# Altium schematic sheet Microcontroller.SchDoc: Smartknob Microcontroller
size A3; DrawnBy: Mani Magnusson; Revision: 1; SheetNumber: 2; SheetTotal: 5
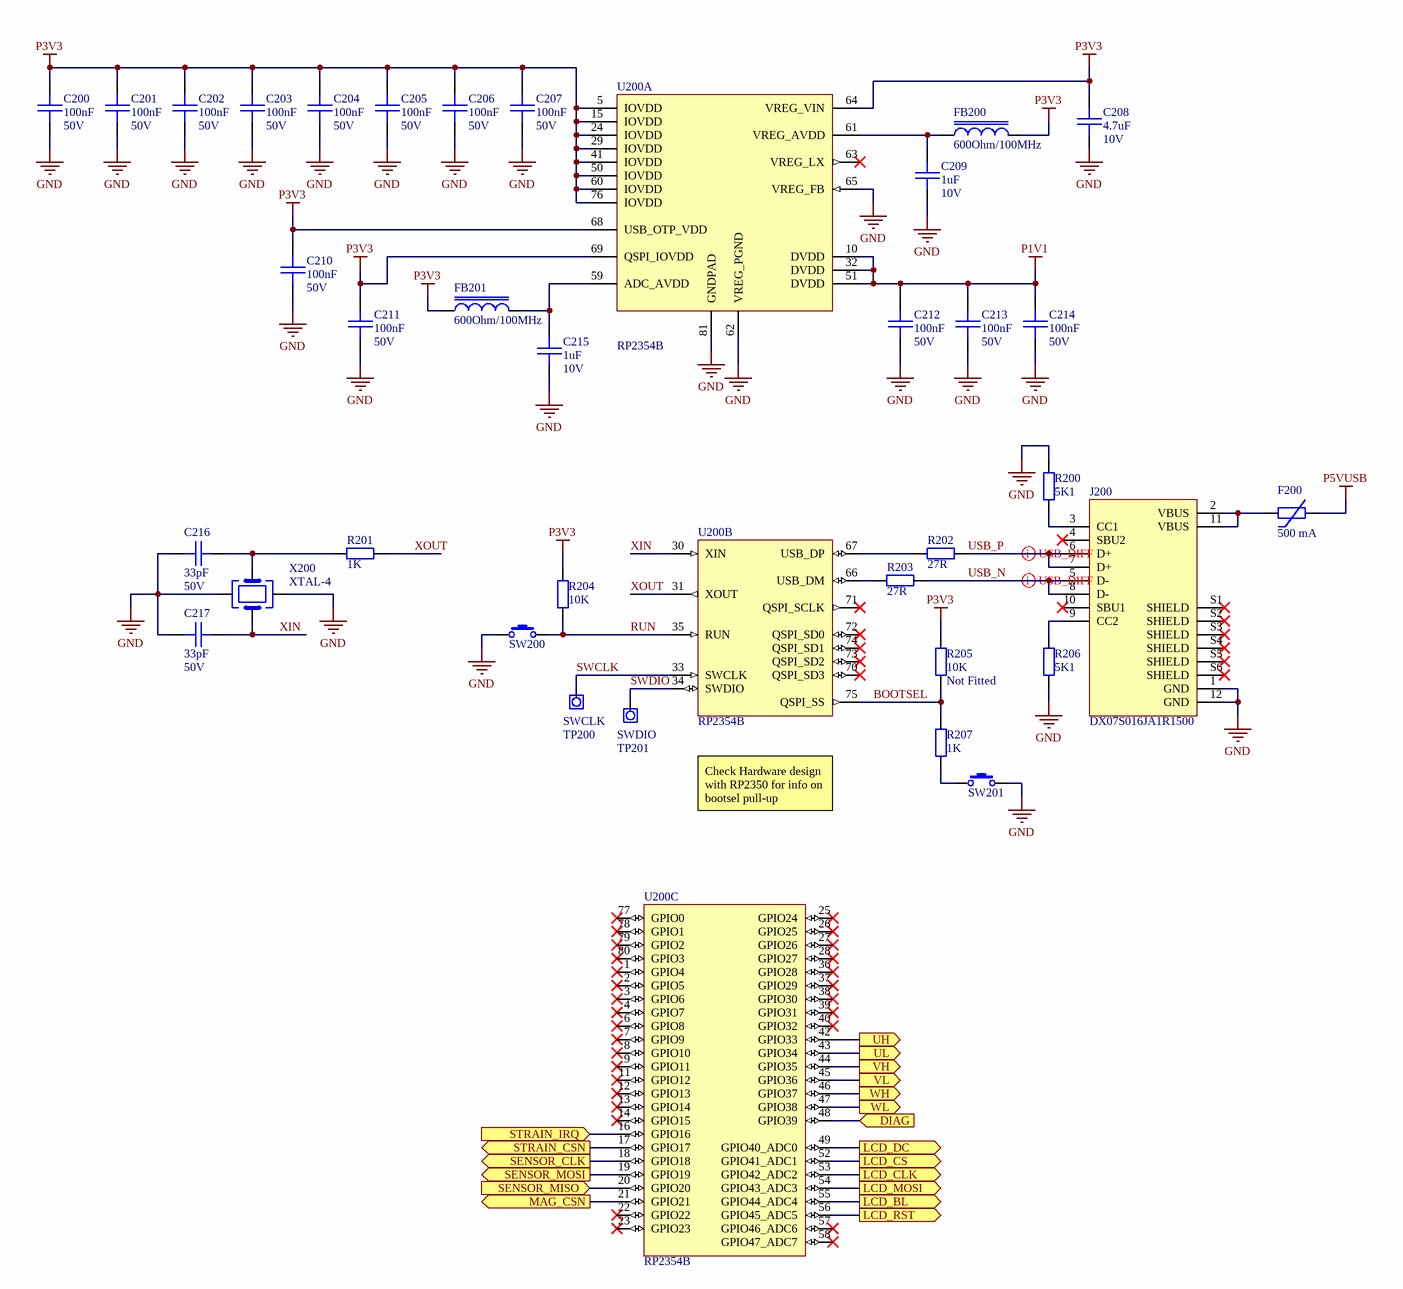
[diagram p0: Microcontroller.SchDoc]

## Parts
C200  value 100nF  Voltage: 50V  [C0402]  (hidden comment: CAP)
C201  value 100nF  Voltage: 50V  [C0402]  (hidden comment: CAP)
C202  value 100nF  Voltage: 50V  [C0402]  (hidden comment: CAP)
C203  value 100nF  Voltage: 50V  [C0402]  (hidden comment: CAP)
C204  value 100nF  Voltage: 50V  [C0402]  (hidden comment: CAP)
C205  value 100nF  Voltage: 50V  [C0402]  (hidden comment: CAP)
C206  value 100nF  Voltage: 50V  [C0402]  (hidden comment: CAP)
C207  value 100nF  Voltage: 50V  [C0402]  (hidden comment: CAP)
C208  value 4.7uF  Voltage: 10V  [C0402]  (hidden comment: CAP)
C209  value 1uF  Voltage: 10V  [C0402]  (hidden comment: CAP)
C210  value 100nF  Voltage: 50V  [C0402]  (hidden comment: CAP)
C211  value 100nF  Voltage: 50V  [C0402]  (hidden comment: CAP)
C212  value 100nF  Voltage: 50V  [C0402]  (hidden comment: CAP)
C213  value 100nF  Voltage: 50V  [C0402]  (hidden comment: CAP)
C214  value 100nF  Voltage: 50V  [C0402]  (hidden comment: CAP)
C215  value 1uF  Voltage: 10V  [C0402]  (hidden comment: CAP)
C216  value 33pF  Voltage: 50V  [C0603]  (hidden comment: CAP)
C217  value 33pF  Voltage: 50V  [C0603]  (hidden comment: CAP)
F200  value 500 mA  [F0805]  (hidden comment: F_PTC)
FB200  value 600Ohm/100MHz  [0603_IND]  (hidden comment: FBEAD)
FB201  value 600Ohm/100MHz  [0603_IND]  (hidden comment: FBEAD)
J200  DX07S016JA1R1500  [DX07S016JA1R1500]
R200  value 5K1  [R0402]  (hidden comment: RES)
R201  value 1K  [R0603]  (hidden comment: RES)
R202  value 27R  [R0402]  (hidden comment: RES)
R203  value 27R  [R0402]  (hidden comment: RES)
R204  value 10K  [R0402]  (hidden comment: RES)
R205  value 10K  Fitted: Not Fitted  [R0402]  (hidden comment: RES)
R206  value 5K1  [R0402]  (hidden comment: RES)
R207  value 1K  [R0402]  (hidden comment: RES)
SW200  Pushbutton  [434133025816]  (value not drawn)
SW201  Pushbutton  [434133025816]  (value not drawn)
TP200  SWCLK  [TP_SMD]
TP201  SWDIO  [TP_SMD]
U200  Manufacturer Part No: RP2354B  [RP235xB]  (hidden comment: RP235xB)  (parts A,B,C of 3)
X200  XTAL-4  [XTAL 3.2x2.5mm]

## Ports
DIAG (in), LCD_BL (out), LCD_CLK (out), LCD_CS (out), LCD_DC (out), LCD_MOSI (out), LCD_RST (out), MAG_CSN (out), SENSOR_CLK (out), SENSOR_MISO (in), SENSOR_MOSI (out), STRAIN_CSN (out), STRAIN_IRQ (in), UH (out), UL (out), VH (out), VL (out), WH (out), WL (out)

## Nets
GND: C200.2 C201.2 C202.2 C203.2 C204.2 C205.2 C206.2 C207.2 C208.2 C209.2 C210.2 C211.2 C212.2 C213.2 C214.2 C215.2 C216.1 C217.1 J200.1(GND) J200.12(GND) R200.2 R206.1 SW200.1 SW201.2 U200.62(VREG_PGND) U200.65(VREG_FB) U200.81(GNDPAD) X200.2 X200.4
P1V1: C212.1 C213.1 C214.1 U200.10(DVDD) U200.32(DVDD) U200.51(DVDD)
P3V3: C200.1 C201.1 C202.1 C203.1 C204.1 C205.1 C206.1 C207.1 C208.1 C210.1 C211.1 FB200.2 FB201.1 R204.2 R205.2 U200.5(IOVDD) U200.15(IOVDD) U200.24(IOVDD) U200.29(IOVDD) U200.41(IOVDD) U200.50(IOVDD) U200.60(IOVDD) U200.64(VREG_VIN) U200.68(USB_OTP_VDD) U200.69(QSPI_IOVDD) U200.76(IOVDD)
P5VUSB: F200.2
BOOTSEL: R205.1 R207.2 U200.75(QSPI_SS)
DIAG: U200.48(GPIO39) ; port DIAG
LCD_BL: U200.55(GPIO44_ADC4) ; port LCD_BL
LCD_CLK: U200.53(GPIO42_ADC2) ; port LCD_CLK
LCD_CS: U200.52(GPIO41_ADC1) ; port LCD_CS
LCD_DC: U200.49(GPIO40_ADC0) ; port LCD_DC
LCD_MOSI: U200.54(GPIO43_ADC3) ; port LCD_MOSI
LCD_RST: U200.56(GPIO45_ADC5) ; port LCD_RST
MAG_CSN: U200.21(GPIO21) ; port MAG_CSN
RUN: R204.1 SW200.2 U200.35(RUN)
SENSOR_CLK: U200.18(GPIO18) ; port SENSOR_CLK
SENSOR_MISO: U200.20(GPIO20) ; port SENSOR_MISO
SENSOR_MOSI: U200.19(GPIO19) ; port SENSOR_MOSI
STRAIN_CSN: U200.17(GPIO17) ; port STRAIN_CSN
STRAIN_IRQ: U200.16(GPIO16) ; port STRAIN_IRQ
SWCLK: TP200.1 U200.33(SWCLK)
SWDIO: TP201.1 U200.34(SWDIO)
UH: U200.42(GPIO33) ; port UH
UL: U200.43(GPIO34) ; port UL
USB_N: J200.5(D-) J200.8(D-) R203.2
USB_P: J200.6(D+) J200.7(D+) R202.2
VH: U200.44(GPIO35) ; port VH
VL: U200.45(GPIO36) ; port VL
WH: U200.46(GPIO37) ; port WH
WL: U200.47(GPIO38) ; port WL
XIN: C217.2 U200.30(XIN) X200.1
XOUT: R201.2 U200.31(XOUT)
NetC209_1: C209.1 FB200.1 U200.61(VREG_AVDD)
NetC215_1: C215.1 FB201.2 U200.59(ADC_AVDD)
NetC216_2: C216.2 R201.1 X200.3
NetF200_1: F200.1 J200.2(VBUS) J200.11(VBUS)
NetJ200_3: J200.3(CC1) R200.1
NetJ200_9: J200.9(CC2) R206.2
NetR202_1: R202.1 U200.67(USB_DP)
NetR203_1: R203.1 U200.66(USB_DM)
NetR207_1: R207.1 SW201.1

Not connected (* = marked no-connect by the designer): J200 4(SBU2)* 10(SBU1)* S1(SHIELD)* S2(SHIELD)* S3(SHIELD)* S4(SHIELD)* S5(SHIELD)* S6(SHIELD)*; U200 1(GPIO4)* 2(GPIO5)* 3(GPIO6)* 4(GPIO7)* 6(GPIO8)* 7(GPIO9)* 8(GPIO10)* 9(GPIO11)* 11(GPIO12)* 12(GPIO13)* 13(GPIO14)* 14(GPIO15)* 22(GPIO22)* 23(GPIO23)* 25(GPIO24)* 26(GPIO25)* 27(GPIO26)* 28(GPIO27)* 36(GPIO28)* 37(GPIO29)* 38(GPIO30)* 39(GPIO31)* 40(GPIO32)* 57(GPIO46_ADC6)* 58(GPIO47_ADC7)* 63(VREG_LX)* 70(QSPI_SD3)* 71(QSPI_SCLK)* 72(QSPI_SD0)* 73(QSPI_SD2)* 74(QSPI_SD1)* 77(GPIO0)* 78(GPIO1)* 79(GPIO2)* 80(GPIO3)*

## Layout directives
differential pair: USB_N, USB_P

## Notes on the sheet
- Check Hardware design with RP2350 for info on bootsel pull-up
- Sheet title:
- Revision:
- Drawn by:
- Date:
- File:

## Library data of the parts
C200-C207 C210-C214 = GRT155R71H104KE01D: General purpose ceramic capacitor; Manufacturer: Murata Electronics; Specification: X7R, 50V, AEC-Q200 Qualified; Ready for use: y; Fitted: Fitted; Package Ref: C0402; Part Reference: GRT155R71H104KE01D; Manufacturer Part No: GRT155R71H104KE01D; Supplier: Digi-Key; Supplier Part No: 490-GRT155R71H104KE01DCT-ND; Generic: Generic
C208 = GRT155R61A475ME13D: General purpose ceramic capacitor; Manufacturer: Murata Electronics; Specification: X5R, 10V, AEC-Q200 Qualified; Ready for use: y; Fitted: Fitted; Package Ref: C0402; Part Reference: GRT155R61A475ME13D; Manufacturer Part No: GRT155R61A475ME13D; Supplier: Digi-Key; Supplier Part No: 490-GRT155R61A475ME13DCT-ND; Generic: Generic
C209 C215 = GRT155R61A105KE01D: General purpose ceramic capacitor; Manufacturer: Murata Electronics; Specification: X5R, 10V, AEC-Q200 Qualified; Ready for use: y; Fitted: Fitted; Package Ref: C0402; Part Reference: GRT155R61A105KE01D; Manufacturer Part No: GRT155R61A105KE01D; Supplier: Digi-Key; Supplier Part No: 490-GRT155R61A105KE01DCT-ND; Generic: Generic
C216 C217 = CGA3E2C0G1H330J080AA: General purpose ceramic capacitor; Manufacturer: TDK Corporation; Specification: C0G, 50V, AEC-Q200 Qualified; Ready for use: y; Fitted: Fitted; Package Ref: C0603; Part Reference: CGA3E2C0G1H330J080AA; Manufacturer Part No: CGA3E2C0G1H330J080AA; Supplier: Digi-Key; Supplier Part No: 445-5634-1-ND; Generic: Generic
F200 = MF-PSMF050X-2: PTC resettable SMD fuse; Manufacturer: Bourns Inc; Specification: 6V rated; Ready for use: y; Fitted: Fitted; Package Ref: F0805; Part Reference: MF-PSMF050X-2; Manufacturer Part No: MF-PSMF050X-2; Supplier: Digi-Key; Supplier Part No: MF-PSMF050X-2CT-ND; Generic: Generic
FB200 FB201 = BLM18KG601SH1D: Ferrite bead; Manufacturer: Murata Electronics; Specification: 1.3A max, AEC-Q200 Qualified; Ready for use: y; Fitted: Fitted; Package Ref: 0603_IND; Part Reference: BLM18KG601SH1D; Manufacturer Part No: BLM18KG601SH1D; Supplier: Digi-Key; Supplier Part No: 490-13259-1-ND; Generic: Generic
J200 = DX07S016JA1R1500: USB 2.0 Type C connector; Manufacturer: JAE Electronics; Generic: Non Generic; Ready for use: y; Fitted: Fitted; Package Ref: DX07S016JA1R1500; Part Reference: DX07S016JA1R1500; Manufacturer Part No: DX07S016JA1R1500; Supplier: Digi-Key; Supplier Part No: 670-DX07S016JA1R1500CT-ND
R200 R202-R207 = Generic 0402 resistor: General purpose resistor; Manufacturer Part No: Generic resistor; Ready for use: y; Package Ref: R0402; Part Reference: Generic 0402 resistor; Manufacturer: N/A; Supplier: N/A; Supplier Part No: N/A; Generic: Generic
  R200 R202-R204 R206 R207: Fitted: Fitted
R201 = CRCW06031K00JNEA: General purpose automotive thick film resistor; Manufacturer: Vishay Dale; Specification: 5%, 200ppm, 0.1W, AEC-Q200 Qualified; Ready for use: y; Fitted: Fitted; Package Ref: R0603; Part Reference: CRCW06031K00JNEA; Manufacturer Part No: CRCW06031K00JNEA; Supplier: Digi-Key; Supplier Part No: 541-1.0KGCT-ND; Generic: Generic
SW200 SW201 = 434133025816: SPST Tactile Switch 4.2x3.2 mm; Manufacturer: Wurth Elektronik; Generic: Non Generic; Ready for use: y; Fitted: Fitted; Package Ref: 434133025816; Part Reference: 434133025816; Manufacturer Part No: 434133025816; Supplier: Digi-Key; Supplier Part No: 732-13663-1-ND
TP200 TP201 = TP_SMD: SMD Testpoint, pad style; Ready for use: y; Fitted: Fitted; Package Ref: TP_SMD; Part Reference: TP_SMD; Generic: Generic
U200 = RP2354B: Dual Core 150 MHz ARM-M33 Microcontroller with 2 MB Flash; Manufacturer: Raspberry Pi; Package Ref: QFN-80 (10x10); Generic: Non Generic; Ready for use: y; Fitted: Fitted; Part Reference: RP2354B; Supplier: Digi-Key; Supplier Part No: 2648-SC1512-A4CT-ND; Type: Microcontroller
X200 = ECS-120-20-33-CKM-TR: 12 MHz 10ppm crystal oscillator; Manufacturer: ECS Inc; Generic: Non Generic; Specification: 20pF, 100R; Value: 12 MHz; Comments: XTAL for RP2040; Ready for use: y; Fitted: Fitted; Package Ref: XTAL 3.2x2.5mm; Part Reference: ECS-120-20-33-CKM-TR; Manufacturer Part No: ECS-120-20-33-CKM-TR; Supplier: Digi-Key; Supplier Part No: XC1810CT-ND